# EAGLE schematic fmcboard_v1.0 (EAGLE 9.5.2)
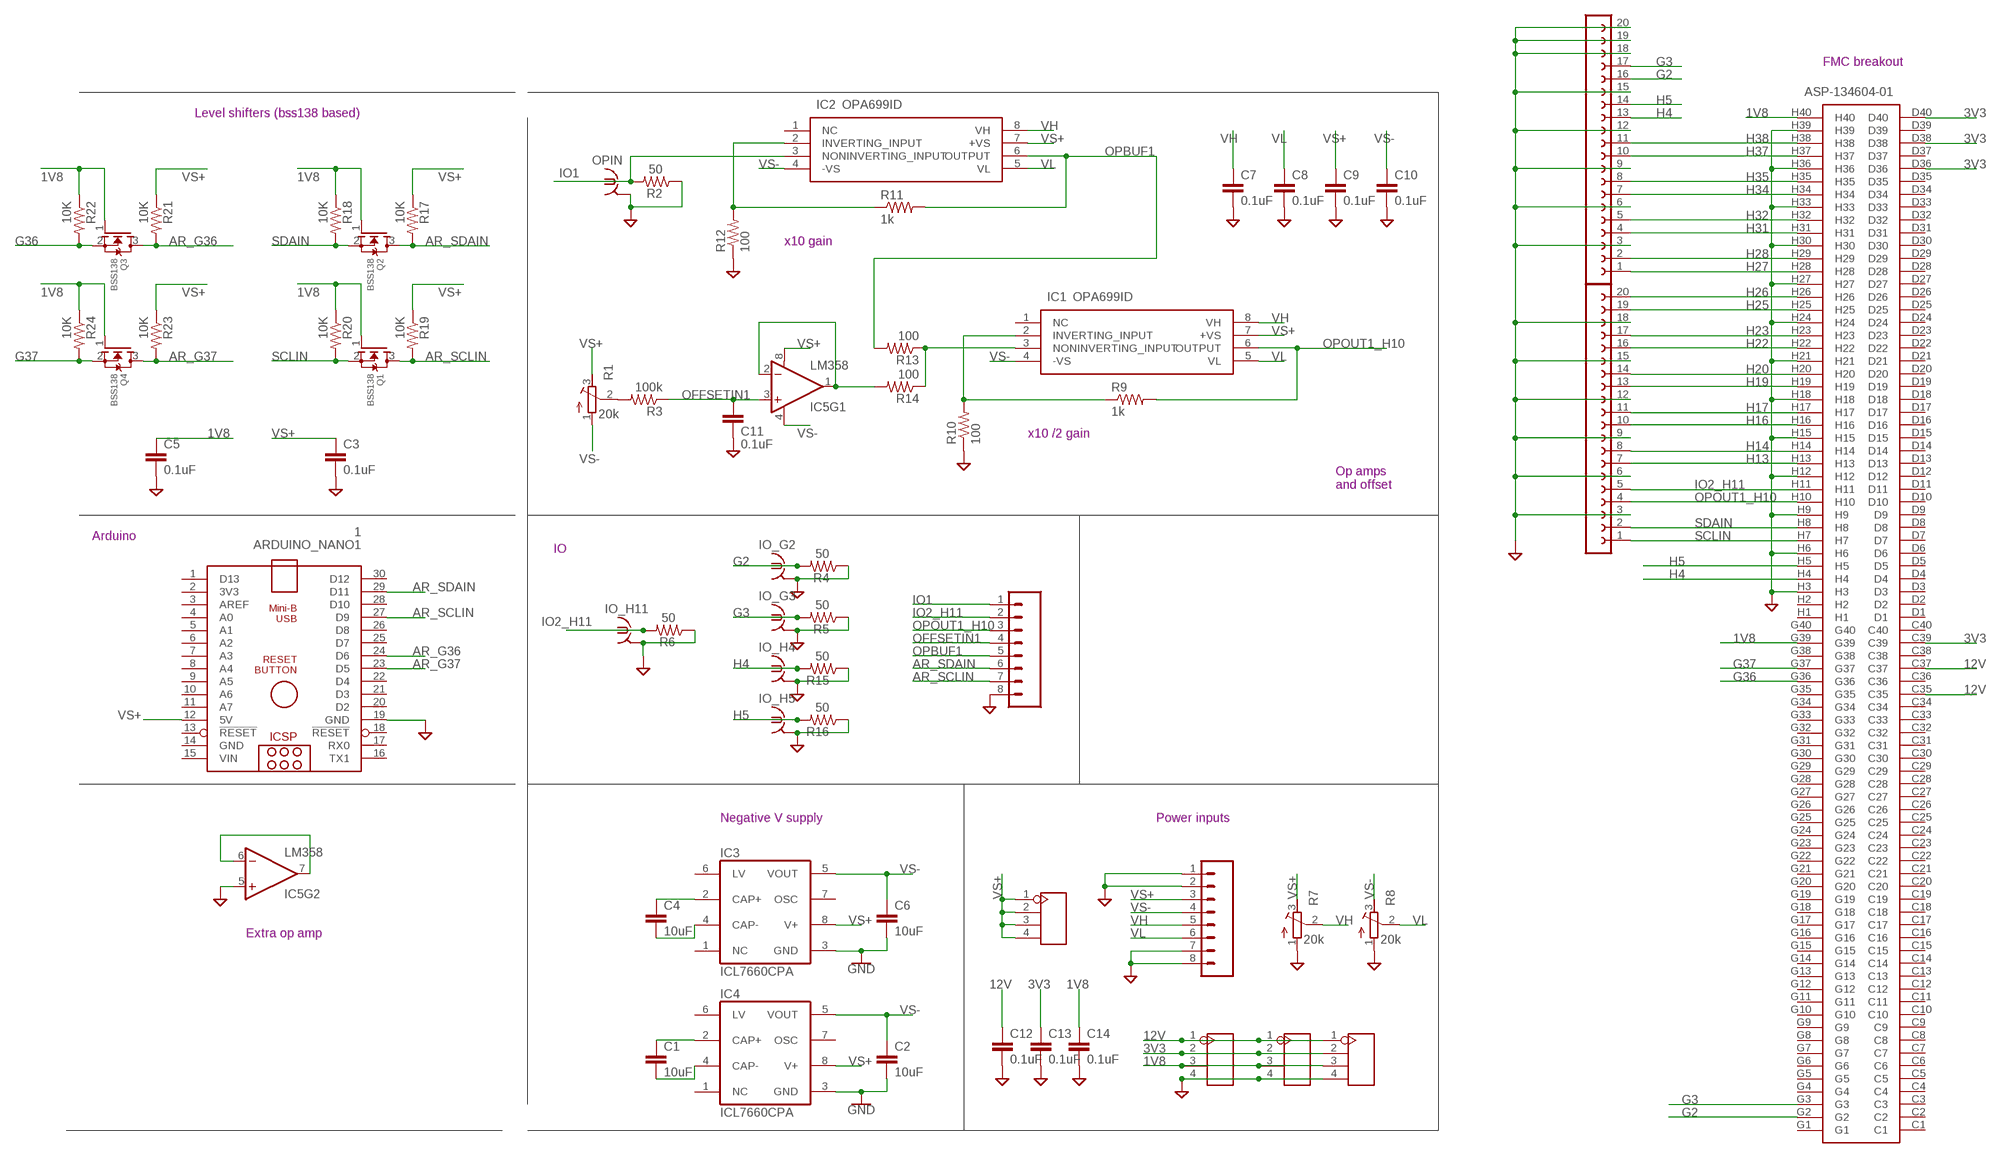
[diagram p0: schematic, sheet 1]

## Parts
ARDUINO_NANO1  1  ARDUINO_NANO  [ARDUINO_NANO]
C1  10uF  CAPPTH1  [CAP-PTH-5MM]
C2  10uF  CAPPTH1  [CAP-PTH-5MM]
C3  0.1uF  CAP0805  [0805]
C4  10uF  CAPPTH1  [CAP-PTH-5MM]
C5  0.1uF  CAP0805  [0805]
C6  10uF  CAPPTH1  [CAP-PTH-5MM]
C7  0.1uF  CAP0805  [0805]
C8  0.1uF  CAP0805  [0805]
C9  0.1uF  CAP0805  [0805]
C10  0.1uF  CAP0805  [0805]
C11  0.1uF  CAP0805  [0805]
C12  0.1uF  CAP0805  [0805]
C13  0.1uF  CAP0805  [0805]
C14  0.1uF  CAP0805  [0805]
IC1  OPA699ID  [SOIC127P600X175-8N]
IC2  OPA699ID  [SOIC127P600X175-8N]
IC3  ICL7660CPA  [DIL08]
IC4  ICL7660CPA  [DIL08]
IC5  LM358  [DIP08]
IO_G2  BU-SMB-V  [BU-SMB-V]
IO_G3  BU-SMB-V  [BU-SMB-V]
IO_H4  BU-SMB-V  [BU-SMB-V]
IO_H5  BU-SMB-V  [BU-SMB-V]
IO_H11  BU-SMB-V  [BU-SMB-V]
J1  8pin  CONN_08"  [1X08]
J2  ASP-134604-01  [ASP13460401]
J3  4p-2.54  DIP-BLACK-FEMALE-HEADER-VERT(4P-2.54)  [H4-2.54]
J4  4p-2.54  DIP-BLACK-FEMALE-HEADER-VERT(4P-2.54)  [H4-2.54]
J5  8pin  CONN_08"  [1X08]
J6  4p-2.54  DIP-BLACK-FEMALE-HEADER-VERT(4P-2.54)  [H4-2.54]
J12  4p-2.54  DIP-BLACK-FEMALE-HEADER-VERT(4P-2.54)  [H4-2.54]
OPIN  BU-SMB-V  [BU-SMB-V]
Q1  BSS138  MOSFET-NREFLOW  [SOT23]
Q2  BSS138  MOSFET-NREFLOW  [SOT23]
Q3  BSS138  MOSFET-NREFLOW  [SOT23]
Q4  BSS138  MOSFET-NREFLOW  [SOT23]
R1  20k  R-TRIMM3296W  [RTRIM3296W]
R2  50  RESISTORAXIAL-0.3  [AXIAL-0.3]
R3  100k  R-US_R0805  [R0805]
R4  50  RESISTORAXIAL-0.3  [AXIAL-0.3]
R5  50  RESISTORAXIAL-0.3  [AXIAL-0.3]
R6  50  RESISTORAXIAL-0.3  [AXIAL-0.3]
R7  20k  R-TRIMM3296W  [RTRIM3296W]
R8  20k  R-TRIMM3296W  [RTRIM3296W]
R9  1k  R-US_R0805  [R0805]
R10  100  R-US_R0805  [R0805]
R11  1k  R-US_R0805  [R0805]
R12  100  R-US_R0805  [R0805]
R13  100  R-US_R0805  [R0805]
R14  100  R-US_R0805  [R0805]
R15  50  RESISTORAXIAL-0.3  [AXIAL-0.3]
R16  50  RESISTORAXIAL-0.3  [AXIAL-0.3]
R17  10K  R-US_R0805  [R0805]
R18  10K  R-US_R0805  [R0805]
R19  10K  R-US_R0805  [R0805]
R20  10K  R-US_R0805  [R0805]
R21  10K  R-US_R0805  [R0805]
R22  10K  R-US_R0805  [R0805]
R23  10K  R-US_R0805  [R0805]
R24  10K  R-US_R0805  [R0805]
SV1  20  FE20-1  [FE20]
SV2  20  FE20-1  [FE20]

## Nets
1V8 [power]: C5.1 C14.1 J2.G39 J2.H40 J3.3 J4.3 J12.3 Q1.1(G) Q2.1(G) Q3.1(G) Q4.1(G) R18.1 R20.1 R22.1 R24.1
3V3 [power]: C13.1 J2.C39 J2.D36 J2.D38 J2.D40 J3.2 J4.2 J12.2
12V [power]: C12.1 J2.C35 J2.C37 J3.1 J4.1 J12.1
AR_G36: ARDUINO_NANO1.24(D6) Q3.3(D) R21.2
AR_G37: ARDUINO_NANO1.23(D5) Q4.3(D) R23.2
AR_SCLIN: ARDUINO_NANO1.27(D9) J5.7 Q1.3(D) R19.2
AR_SDAIN: ARDUINO_NANO1.29(D11) J5.6 Q2.3(D) R17.2
G2: IO_G2.1 J2.G2 R4.P$2 SV2.16
G3: IO_G3.1 J2.G3 R5.P$2 SV2.17
G36: J2.G36 Q3.2(S) R22.2
G37: J2.G37 Q4.2(S) R24.2
GND [gnd]: ARDUINO_NANO1.19(GND) C2.2 C3.2 C5.2 C6.2 C7.2 C8.2 C9.2 C10.2 C11.2 C12.2 C13.2 C14.2 IC3.3(GND) IC4.3(GND) IC5.5(+IN) IO_G2.2 IO_G2.3 IO_G2.4 IO_G2.5 IO_G3.2 IO_G3.3 IO_G3.4 IO_G3.5 IO_H4.2 IO_H4.3 IO_H4.4 IO_H4.5 IO_H5.2 IO_H5.3 IO_H5.4 IO_H5.5 IO_H11.2 IO_H11.3 IO_H11.4 IO_H11.5 J1.1 J1.2 J1.7 J1.8 J2.H3 J2.H6 J2.H9 J2.H12 J2.H15 J2.H18 J2.H21 J2.H24 J2.H27 J2.H30 J2.H33 J2.H36 J2.H39 J3.4 J4.4 J5.8 J12.4 OPIN.2 OPIN.3 OPIN.4 OPIN.5 R2.P$1 R4.P$1 R5.P$1 R6.P$1 R7.1(A) R8.1(A) R10.1 R12.1 R15.P$1 R16.P$1 SV1.3 SV1.6 SV1.9 SV1.12 SV1.15 SV1.18 SV2.3 SV2.6 SV2.9 SV2.12 SV2.15 SV2.18 SV2.19 SV2.20
H4: IO_H4.1 J2.H4 R15.P$2 SV2.13
H5: IO_H5.1 J2.H5 R16.P$2 SV2.14
H13: J2.H13 SV1.7
H14: J2.H14 SV1.8
H16: J2.H16 SV1.10
H17: J2.H17 SV1.11
H19: J2.H19 SV1.13
H20: J2.H20 SV1.14
H22: J2.H22 SV1.16
H23: J2.H23 SV1.17
H25: J2.H25 SV1.19
H26: J2.H26 SV1.20
H27: J2.H28 SV2.1
H28: J2.H29 SV2.2
H31: J2.H31 SV2.4
H32: J2.H32 SV2.5
H34: J2.H34 SV2.7
H35: J2.H35 SV2.8
H37: J2.H37 SV2.10
H38: J2.H38 SV2.11
IO1: IC2.3(NONINVERTING_INPUT) J5.1 OPIN.1 R2.P$2
IO2_H11: IO_H11.1 J2.H11 J5.2 R6.P$2 SV1.5
N$1: IC1.3(NONINVERTING_INPUT) R13.1 R14.1
N$2: C4.1 IC3.2(CAP+)
N$3: IC1.2(INVERTING_INPUT) R9.1 R10.2
N$4: C4.2 IC3.4(CAP-)
N$5: C1.1 IC4.2(CAP+)
N$6: C1.2 IC4.4(CAP-)
N$7: IC2.2(INVERTING_INPUT) R11.1 R12.2
N$8: R1.2(S) R3.2
N$9: IC5.6(-IN) IC5.7(OUT)
OFFSETIN1: C11.1 IC5.3(+IN) J5.4 R3.1
OPBUF1: IC2.6(OUTPUT) J5.5 R11.2 R13.2
OPOUT1_H10: IC1.6(OUTPUT) J2.H10 J5.3 R9.2 SV1.4
SCLIN: J2.H7 Q1.2(S) R20.2 SV1.1
SDAIN: J2.H8 Q2.2(S) R18.2 SV1.2
VH: C7.1 IC1.8(VH) IC2.8(VH) J1.5 R7.2(S)
VIN1: IC5.1(OUT) IC5.2(-IN) R14.2
VL: C8.1 IC1.5(VL) IC2.5(VL) J1.6 R8.2(S)
VS+ [power]: ARDUINO_NANO1.12(5V) C3.1 C9.1 IC1.7(+VS) IC2.7(+VS) IC3.8(V+) IC4.8(V+) IC5.8(V+) J1.3 J6.1 J6.2 J6.3 J6.4 R1.3(E) R7.3(E) R17.1 R19.1 R21.1 R23.1
VS- [power]: C2.1 C6.1 C10.1 IC1.4(-VS) IC2.4(-VS) IC3.5(VOUT) IC4.5(VOUT) IC5.4(V-) J1.4 R1.1(A) R8.3(E)
Unconnected: ARDUINO_NANO1.1(D13) ARDUINO_NANO1.2(3V3) ARDUINO_NANO1.3(AREF) ARDUINO_NANO1.4(A0) ARDUINO_NANO1.5(A1) ARDUINO_NANO1.6(A2) ARDUINO_NANO1.7(A3) ARDUINO_NANO1.8(A4) ARDUINO_NANO1.9(A5) ARDUINO_NANO1.10(A6) ARDUINO_NANO1.11(A7) ARDUINO_NANO1.13(!RESET) ARDUINO_NANO1.16(TX1) ARDUINO_NANO1.17(RX0) ARDUINO_NANO1.18(!RESET) ARDUINO_NANO1.20(D2) ARDUINO_NANO1.21(D3) ARDUINO_NANO1.22(D4) ARDUINO_NANO1.25(D7) ARDUINO_NANO1.26(D8) ARDUINO_NANO1.28(D10) ARDUINO_NANO1.30(D12) IC1.1(NC) IC2.1(NC) IC3.1(NC) IC3.6(LV) IC3.7(OSC) IC4.1(NC) IC4.6(LV) IC4.7(OSC) J2.C1 J2.C2 J2.C3 J2.C4 J2.C5 J2.C6 J2.C7 J2.C8 J2.C9 J2.C10 J2.C11 J2.C12 J2.C13 J2.C14 J2.C15 J2.C16 J2.C17 J2.C18 J2.C19 J2.C20 J2.C21 J2.C22 J2.C23 J2.C24 J2.C25 J2.C26 J2.C27 J2.C28 J2.C29 J2.C30 J2.C31 J2.C32 J2.C33 J2.C34 J2.C36 J2.C38 J2.C40 J2.D1 J2.D2 J2.D3 J2.D4 J2.D5 J2.D6 J2.D7 J2.D8 J2.D9 J2.D10 J2.D11 J2.D12 J2.D13 J2.D14 J2.D15 J2.D16 J2.D17 J2.D18 J2.D19 J2.D20 J2.D21 J2.D22 J2.D23 J2.D24 J2.D25 J2.D26 J2.D27 J2.D28 J2.D29 J2.D30 J2.D31 J2.D32 J2.D33 J2.D34 J2.D35 J2.D37 J2.D39 J2.G1 J2.G4 J2.G5 J2.G6 J2.G7 J2.G8 J2.G9 J2.G10 J2.G11 J2.G12 J2.G13 J2.G14 J2.G15 J2.G16 J2.G17 J2.G18 J2.G19 J2.G20 J2.G21 J2.G22 J2.G23 J2.G24 J2.G25 J2.G26 J2.G27 J2.G28 J2.G29 J2.G30 J2.G31 J2.G32 J2.G33 J2.G34 J2.G35 J2.G38 J2.G40 J2.H1 J2.H2

## Notes on the sheet
- FMC breakout
- Level shifters (bss138 based)
- x10 gain
- x10 /2 gain
- Op amps
  and offset
- Arduino
- IO
- Negative V supply | Power inputs
- Extra op amp

## Power pins joined to a net without a drawn wire
GND: ARDUINO_NANO1.14(GND)
VIN: ARDUINO_NANO1.15(VIN)

## Library data of the parts
ARDUINO_NANO1 = ArduinoNanoV30:ARDUINO_NANO: Arduino Nano V3.0 Overview: The Arduino Nano is a small, complete, and breadboard-friendly board based on the ATmega328 (Arduino Nano 3.x) or ATmega168 (Arduino Nano 2.x). It has more or less the same functionality of the Arduino Duemilanove, but in a different package. It lacks only a DC power jack, and works with a Mini-B USB cable instead of a standard one. The Nano was designed and is being produced by Gravitech. Specifications: Microcontroller Atmel ATmega168 or ATmega328 Operating Voltage (logic level) 5 V Input Voltage (recommended) 7-12 V Input Voltage (limits) 6-20 V Digital I/O Pins 14 (of which 6 provide PWM output) Analog Input Pins 8 DC Current per I/O Pin 40 mA Flash Memory 16 KB (ATmega168) or 32 KB (ATmega328) of which 2 KB used by bootloader SRAM 1 KB (ATmega168) or 2 KB (ATmega328) EEPROM 512 bytes (ATmega168) or 1 KB (ATmega328) Clock Speed 16 MHz Dimensions 0.73" x 1.70" Length 45 mm Width 18 mm Weigth 5 g Power: The Arduino Nano can be powered via the Mini-B USB connection, 6-20V unregulated external power supply (pin 30), or 5V regulated external power supply (pin 27). The power source is automatically selected to the highest voltage source. Memory: The ATmega168 has 16 KB of flash memory for storing code (of which 2 KB is used for the bootloader); the ATmega328 has 32 KB, (also with 2 KB used for the bootloader). The ATmega168 has 1 KB of SRAM and 512 bytes of EEPROM (which can be read and written with the EEPROM library); the ATmega328 has 2 KB of SRAM and 1 KB of EEPROM. Input and Output: Each of the 14 digital pins on the Nano can be used as an input or output, using pinMode(), digitalWrite(), and digitalRead() functions. They operate at 5 volts. Each pin can provide or receive a maximum of 40 mA and has an internal pull-up resistor (disconnected by default) of 20-50 kOhms. In addition, some pins have specialized functions. Visit Arduino - ArduinoBoardNano <https://www.arduino.cc/en/Main/ArduinoBoardNano>
C1 C2 C4 C6 = SparkFun-Capacitors:CAP: Capacitor Standard 0603 ceramic capacitor, and 0.1" leaded capacitor.
C3 C5 C7-C14 = SparkFun-Passives:CAP: Capacitor Standard 0603 ceramic capacitor, and 0.1" leaded capacitor.
IC1 IC2 = OPA699ID:OPA699ID: Texas Instruments OPA699ID Op Amp, 880MHz, 9 V, 8-Pin SOIC Source: Datasheet <http://www.ti.com/lit/gpn/opa699>; DESCRIPTION: Texas Instruments OPA699ID Op Amp, 880MHz, 9 V, 8-Pin SOIC; HEIGHT: 1.75mm; MANUFACTURER_NAME: Texas Instruments; MANUFACTURER_PART_NUMBER: OPA699ID; MOUSER_PART_NUMBER: 595-OPA699ID; MOUSER_PRICE-STOCK: https://www.mouser.co.uk/ProductDetail/Texas-Instruments/OPA699ID?qs=wgAEGBTxy7n0Nk%252BpyQzyiA%3D%3D
IC3 IC4 = maxim:ICL7660CPA: VOLTAGE CONVERTER; MF: INTERSIL; MPN: ICL7660CPA; OC_FARNELL: 1018170; OC_NEWARK: 06F7441
IC5 = SparkFun-AnalogIC:LM358: Jellybean op-amp; PROD_ID: IC-09172
IO_G2 IO_G3 IO_H4 IO_H5 IO_H11 OPIN = con-coax:BU-SMB-V: FEMALE SMB CONNECTOR Radiall distributor RS 112-2993; OC_FARNELL: unknown; OC_NEWARK: unknown
J1 J5 = SparkFun-Connectors:CONN_08: Multi connection point. Often used as Generic Header-pin footprint for 0.1 inch spaced/style header connections On any of the 0.1 inch spaced packages, you can populate with these: Break Away Headers - Straight <https://www.sparkfun.com/products/116> (PRT-00116) Break Away Male Headers - Right Angle <https://www.sparkfun.com/products/553> (PRT-00553) Female Headers <https://www.sparkfun.com/products/115> (PRT-00115) Break Away Headers - Machine Pin <https://www.sparkfun.com/products/117> (PRT-00117) Break Away Female Headers - Swiss Machine Pin <https://www.sparkfun.com/products/743> (PRT-00743) Arduino Stackable Header - 8 Pin <https://www.sparkfun.com/products/9279> (PRT-09279) For SCREWTERMINALS and SPRING TERMINALS visit here: Screw Terimnals on SparkFun.com <https://www.sparkfun.com/search/results?term=Screw+Terminals> (5mm/3.5mm/2.54mm spacing) This device is also useful as a general connection point to wire up your design to another part of your project. Our various solder wires solder well into these plated through hole pads. Hook-Up Wire - Assortment (Stranded, 22 AWG) <https://www.sparkfun.com/products/11375> (PRT-11375) Hook-Up Wire - Assortment (Solid Core, 22 AWG) <https://www.sparkfun.com/products/11367> (PRT-11367) View the entire wire category on our website here <https://www.sparkfun.com/categories/141> Special notes: Molex polarized connector foot print use with SKU : PRT-08231 with associated crimp pins and housings. 1MM SMD Version SKU: PRT-10208 NOTES ON THE VARIANTS LOCK and LOCK_LONGPADS... This footprint was designed to help hold the alignment of a through-hole component (i.e. 6-pin header) while soldering it into place. You may notice that each hole has been shifted either up or down by 0.005 of an inch from it's more standard position (which is a perfectly straight line). This slight alteration caused the pins (the squares in the middle) to touch the edges of the holes. Because they are alternating, it causes a "brace" to hold the component in place. 0.005 has proven to be the perfect amount of "off-center" position when using our standard breakaway headers. Although looks a little odd when you look at the bare footprint, once you have a header in there, the alteration is very hard to notice. Also,if you push a header all the way into place, it is covered up entirely on the bottom side.; PROD_ID: CONN-08438
J2 = ASP-134604-01:ASP-134604-01: SAMTEC - ASP-134604-01 - Board-To-Board Connector, Vita 57 XMC, 1.27 mm, 160 Contacts, Header, ASP Series, Surface Mount Source: Datasheet <https://componentsearchengine.com/Datasheets/2/ASP-134604-01.pdf>; DESCRIPTION: SAMTEC - ASP-134604-01 - Board-To-Board Connector, Vita 57 XMC, 1.27 mm, 160 Contacts, Header, ASP Series, Surface Mount; HEIGHT: 7.11mm; MANUFACTURER_NAME: SAMTEC; MANUFACTURER_PART_NUMBER: ASP-134604-01; MOUSER_PART_NUMBER: 200-ASP-134604-01; MOUSER_PRICE-STOCK: https://www.mouser.co.uk/ProductDetail/Samtec/ASP-134604-01?qs=Rp%2FUEJiACm00i8g2mQ6XNw%3D%3D
J3 J4 J6 J12 = Seeed-Connector:DIP-BLACK-FEMALE-HEADER-VERT(4P-2.54): 320030017; MPN: F185-1104A1BSYA1
Q1-Q4 = adafruit:MOSFET-N: N-Channel Mosfet 2N7002E - 60V 260mA SOT23 [Digikey: 2N7002ET1GOSTR-ND] - REEL BSH103 - 30V 850mA SOT23 [Digikey: 568-5013-1-ND]
R1 R7 R8 = resistor:R-TRIMM: Trimm resistor
R2 R4-R6 R15 R16 = SparkFun-Resistors:RESISTOR: Resistor Basic schematic elements and footprints for 0603, 1206, and PTH resistors.
R3 R9-R14 = rcl:R-US_: RESISTOR, American symbol; SPICEPREFIX: R
R17-R24 = adafruit:R-US_: RESISTOR, American symbol
SV1 SV2 = con-lsta:FE20-1: FEMALE HEADER; OC_FARNELL: unknown; OC_NEWARK: unknown

## Net classes
0 default: width 0.305 mm
1 power: width 0.508 mm
2 gnd: width 0.305 mm